# EAGLE design nano24rf (EAGLE 8.0.0)

## Sheet 1 of 2
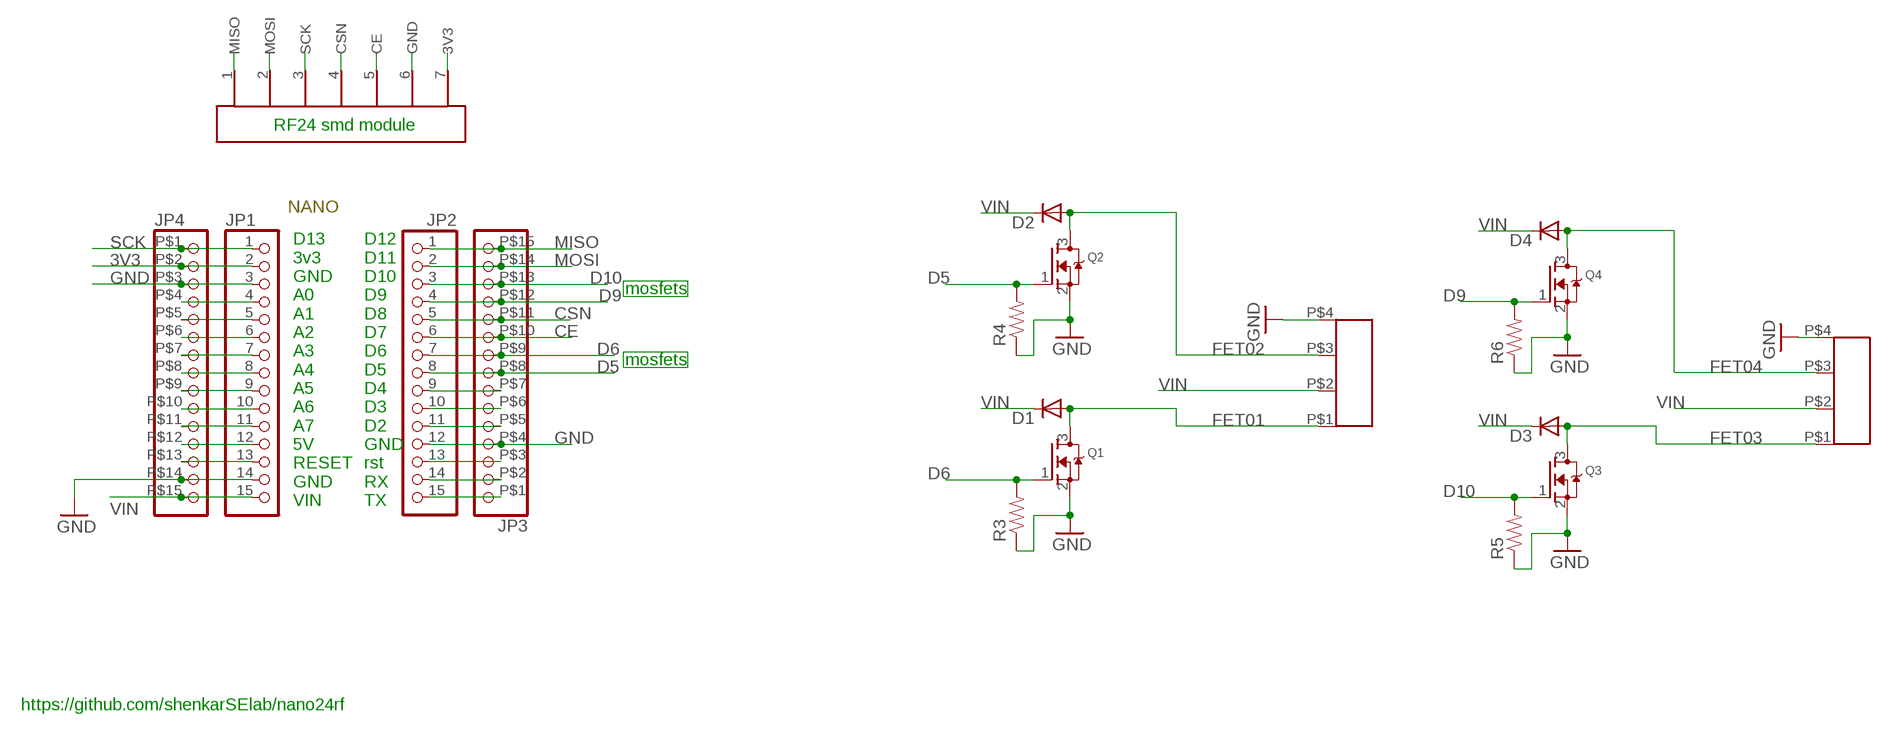
[diagram p0: schematic, sheet 1]

### Parts
D1  DIODE-DO-214AC  [DO-214AC]
D2  DIODE-DO-214AC  [DO-214AC]
D3  DIODE-DO-214AC  [DO-214AC]
D4  DIODE-DO-214AC  [DO-214AC]
JP1  HEADER-1X15RND  [1X15_ROUND_70]
JP2  HEADER-1X15RND  [1X15_ROUND_70]
JP3  HEADER-1X15LONG  [1X15_LONG]
JP4  HEADER-1X15LONG  [1X15_LONG]
MOSFET-12  FATPAD4LONG  [FATFAD4-LONG]
MOSFET-34  FATPAD4LONG  [FATFAD4-LONG]
Q1  MOSFET-NWAVE  [SOT23-W]
Q2  MOSFET-NWAVE  [SOT23-W]
Q3  MOSFET-NWAVE  [SOT23-W]
Q4  MOSFET-NWAVE  [SOT23-W]
R3  RESISTOR0805-RES  [0805]
R4  RESISTOR0805-RES  [0805]
R5  RESISTOR0805-RES  [0805]
R6  RESISTOR0805-RES  [0805]
RF24  1X7-SMDPADS  [SMD1,27-2,54]

### Nets
3V3: JP1.2 JP4.P$2 RF24.7(3V3)
CE: JP2.6 JP3.P$10 RF24.5(CE)
CSN: JP2.5 JP3.P$11 RF24.4(CSN)
D5: JP2.8 JP3.P$8 Q2.1(G) R4.2
D6: JP2.7 JP3.P$9 Q1.1(G) R3.2
D9: JP2.4 JP3.P$12 Q4.1(G) R6.2
D10: JP2.3 JP3.P$13 Q3.1(G) R5.2
FET01: D1.2(A) MOSFET-12.P$1 Q1.3(D)
FET02: D2.2(A) MOSFET-12.P$3 Q2.3(D)
FET03: D3.2(A) MOSFET-34.P$1 Q3.3(D)
FET04: D4.2(A) MOSFET-34.P$3 Q4.3(D)
GND: JP1.3 JP1.14 JP2.12 JP3.P$4 JP4.P$3 JP4.P$14 MOSFET-12.P$4 MOSFET-34.P$4 Q1.2(S) Q2.2(S) Q3.2(S) Q4.2(S) R3.1 R4.1 R5.1 R6.1 RF24.6(GND)
MISO: JP2.1 JP3.P$15 RF24.1(MISO)
MOSI: JP2.2 JP3.P$14 RF24.2(MOSI)
N$1: JP1.4 JP4.P$4
N$2: JP1.5 JP4.P$5
N$3: JP1.6 JP4.P$6
N$4: JP1.7 JP4.P$7
N$5: JP1.8 JP4.P$8
N$6: JP1.9 JP4.P$9
N$7: JP1.10 JP4.P$10
N$8: JP1.11 JP4.P$11
N$9: JP1.12 JP4.P$12
N$10: JP1.13 JP4.P$13
N$11: JP2.15 JP3.P$1
N$12: JP2.14 JP3.P$2
N$13: JP2.13 JP3.P$3
N$14: JP2.11 JP3.P$5
N$15: JP2.10 JP3.P$6
N$16: JP2.9 JP3.P$7
SCK: JP1.1 JP4.P$1 RF24.3(SCK)
VIN: D1.1(C) D2.1(C) D3.1(C) D4.1(C) JP1.15 JP4.P$15 MOSFET-12.P$2 MOSFET-34.P$2

### Notes on the sheet
- RF24 smd module
- NANO
- mosfets
- mosfets
- D13
  3v3
  GND
  A0
  A1
  A2
  A3
  A4
  A5
  A6
  A7
  5V
  RESET
  GND
  VIN
- D12
  D11
  D10
  D9
  D8
  D7
  D6
  D5
  D4
  D3
  D2
  GND
  rst
  RX
  TX
- https://github.com/shenkarSElab/nano24rf

## Sheet 2 of 2

## Library data of the parts
D1-D4 = dp_devices:DIODE: Various Diode Packages
JP1-JP4 = nano24rf:HEADER-1X15: 1x15 Header
MOSFET-12 MOSFET-34 = nano24rf:FATPAD4
Q1-Q4 = adafruit:MOSFET-N: N-Channel Mosfet 2N7002E - 60V 260mA SOT23 [Digikey: 2N7002ET1GOSTR-ND] - REEL BSH103 - 30V 850mA SOT23 [Digikey: 568-5013-1-ND]
R3-R6 = ATTAMI-V0.00:RESISTOR: Resistor Basic schematic elements and footprints for 0603, 1206, and PTH resistors.
RF24 = nano24rf:1X7-SMDPADS

## Board
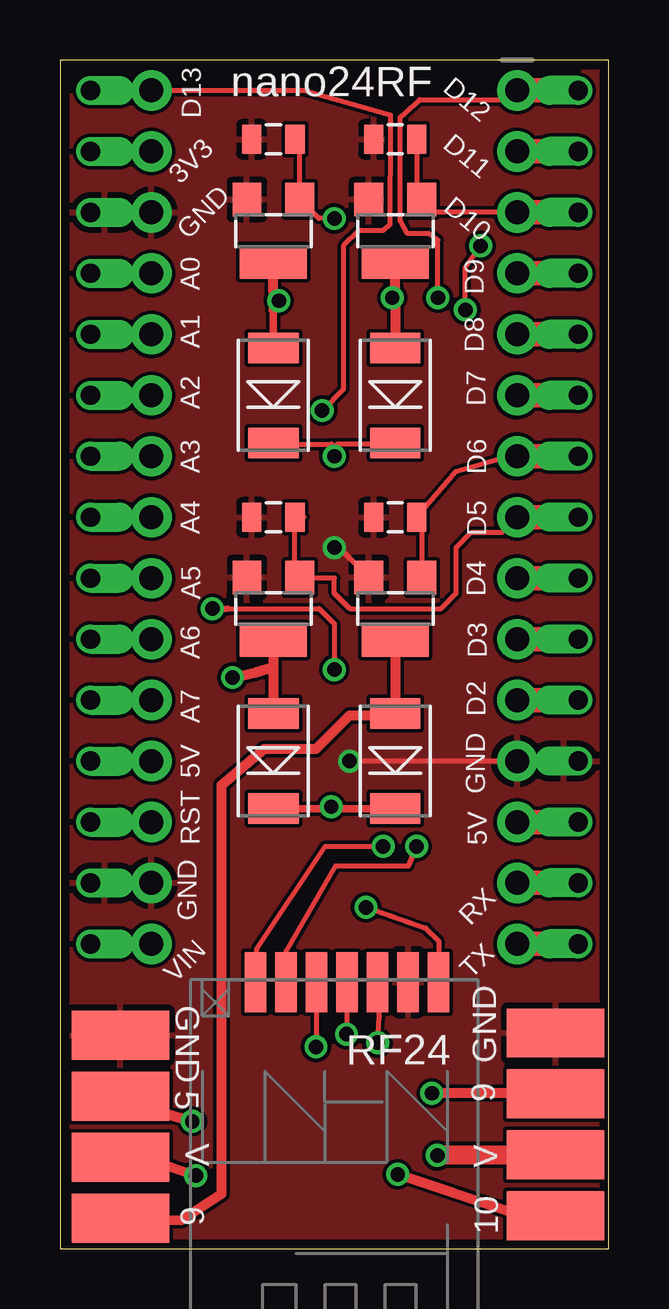
[diagram p1: board, top side]
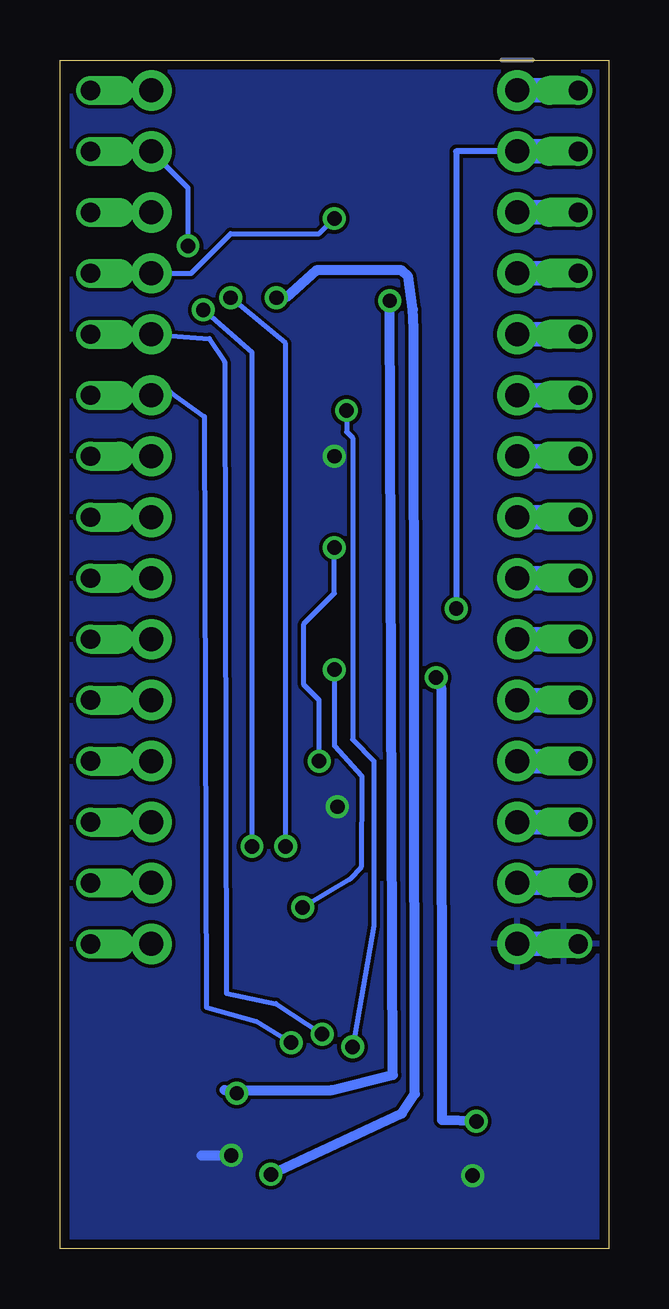
[diagram p2: board, bottom side, seen from below]

Size 22.86 x 49.53 mm. Coordinates in mm from the lower left corner, seen from the top.
Outline: 0,0 22.86,0 22.86,49.53 0,49.53 0,0
Copper layers (1*16): Top 0.0356mm / dielectric 1.5011mm / Bottom 0.0356mm
Design rules "oshpark-2layer": minimum track width 6mil, minimum drill 13mil, track to track 6mil, track to pad 6mil, pad to pad 6mil, via to via 6mil, smd to smd 6mil, copper to edge 15mil, drill to drill 6mil, minimum pad ring 7mil, minimum via ring 7mil, stop-mask expansion 2.5mil, vias tented up to drill 0mil, thermal gap 10mil

### Footprints (pad centres in the part's own frame; a part is rotated, then mirrored left to right if it is on the bottom)
DO-214AC = smd 1.27 x 2.1: 1 -1.98,0; 2 1.98,0
1X15_ROUND_70 = drill 1 pad 1.676: 1 -17.78,0; 2 -15.24,0; 3 -12.7,0; 4 -10.16,0; 5 -7.62,0; 6 -5.08,0; 7 -2.54,0; 8 0,0; 9 2.54,0; 10 5.08,0; 11 7.62,0; 12 10.16,0; 13 12.7,0; 14 15.24,0; 15 17.78,0
1X15_LONG = drill 0.8 offset: P$1 -17.78,0; P$2 -15.24,0; P$3 -12.7,0; P$4 -10.16,0; P$5 -7.62,0; P$6 -5.08,0; P$7 -2.54,0; P$8 0,0; P$9 2.54,0; P$10 5.08,0; P$11 7.62,0; P$12 10.16,0; P$13 12.7,0; P$14 15.24,0; P$15 17.78,0
FATFAD4-LONG = smd 2.032 x 4.064: P$1 -3.81,0; P$2 -1.27,0; P$3 1.27,0; P$4 3.81,0
SOT23-W = smd 1.2 x 1.4: 1 -1.1,-1.3; 2 1.1,-1.3 | smd 2.8 x 1.4: 3 0,1.3
0805 = smd 0.8 x 1.2: 1 -0.9,0; 2 0.9,0
SMD1,27-2,54 = smd 0.9 x 2.5: 1 2.82,-0.19; 2 4.09,-0.19; 3 5.36,-0.19; 4 6.63,-0.19; 5 7.9,-0.19; 6 9.17,-0.19; 7 10.44,-0.19

### Placement (x,y rotation side)
D1  13.97,20.32 90 top
D2  8.89,20.32 90 top
D3  13.97,35.56 90 top
D4  8.89,35.56 90 top
JP1  3.81,30.48 270 bottom
JP2  19.05,30.48 270 top
JP3  21.59,30.48 90 bottom
JP4  1.27,30.48 270 bottom
MOSFET-12  2.51,5.08 90 top
MOSFET-34  20.65,5.18 90 top
Q1  13.97,26.67 180 top
Q2  8.89,26.67 180 top
Q3  13.97,42.42 180 top
Q4  8.89,42.42 180 top
R3  13.97,30.48 0 top
R4  8.89,30.48 0 top
R5  13.97,46.23 0 top
R6  8.89,46.23 0 top
RF24  5.33,11.3 0 top

### Tracks (layer width: path | path; a pad name or v marks a point on that pad's centre or on a via)
3V3  (via drill 0.6)
  Top 0.203: 6.99,26.67 10.8,26.67 11.43,26.04 v11.43,24.13 | v12.75,14.22 15.25,13.36 15.77,12.83 RF24.7
  Top 0.254: v6.35,26.67 6.99,26.67
  Bottom 0.203: v11.43,24.13 11.43,20.95 10.29,19.68 10.31,15.9 10.8,15.39 v12.75,14.22
  Bottom 0.254: JP1.2 6.35,45.72 v6.35,26.67
  Bottom 1.016: JP4.P$2 JP1.2
CE  (via drill 0.6)
  Top 0.203: v13.23,8.59 13.31,9.69 RF24.5
  Top 1.016: JP3.P$10 JP2.6
  Bottom 0.203: JP2.6 18.26,35.69 16.84,34.67 16.76,10.06 14.68,9.47 v13.23,8.59
CSN  (via drill 0.6)
  Top 0.203: v11.94,8.94 11.96,9.46 RF24.4
  Top 1.016: JP3.P$11 JP2.5
  Bottom 0.203: JP2.5 16.64,37.92 16,36.96 15.93,10.64 13.87,10.21 v11.94,8.94
D5
  Top 0.203: 10.16,30.48 R4.2 9.79,28.17 Q2.1 10.02,27.94 11.43,27.94 11.43,27.3 12.07,26.67 15.88,26.67 16.51,27.3 16.51,29.21 17.14,29.84 18.41,29.84 JP2.8
  Top 1.016: JP3.P$8 JP2.8
D6
  Top 0.203: JP2.7 18.68,33.02 16.51,32.38 R3.2 15.07,30.28 Q1.1
  Top 1.016: JP3.P$9 JP2.7
D9  (via drill 0.6)
  Top 0.203: R6.2 arc-90 9.99,46.03 Q4.1 10.78,42.93 v11.43,42.93
  Top 1.016: JP2.4 JP3.P$12
  Bottom 0.203: JP2.4 17.4,40.64 15.75,42.29 12.07,42.29 v11.43,42.93
D10
  Top 0.203: R5.2 14.87,43.92 arc90 Q3.1 15.61,43.18 JP2.3
  Top 1.016: JP2.3 JP3.P$13
FET01
  Top 0.305: 13.89,22.23 D1.2
  Top 0.406: MOSFET-12.P$1 5.05,1.19 6.73,2.29 6.73,19.33 8.51,20.83 10.67,20.83 12.07,22.23 13.89,22.23 | Q1.3 D1.2
FET02  (via drill 0.6)
  Top 0.305: MOSFET-12.P$3 1.98,6.33
  Top 0.406: Q2.3 8.89,24.26 | 8.89,24.26 D2.2 | 1.98,6.33 v5.51,5.31 | v7.19,23.8 8.18,24.03 8.89,24.26
  Bottom 0.406: v5.51,5.31 6.93,5.36 6.96,23.29 7.06,23.75 v7.19,23.8
FET03  (via drill 0.6)
  Top 0.203: MOSFET-34.P$1 18.8,1.52
  Top 0.305: v13.84,39.62 13.97,39.75
  Top 0.406: 18.8,1.52 v14.07,3.1 | 13.97,39.75 Q3.3 | v13.84,39.62 13.97,39.5 D3.2
  Bottom 0.406: v14.07,3.1 8.61,5.64 8.08,6.45 8.13,38.33 8.15,39.14 8.36,40.51 8.61,40.77 12.19,40.77 13.46,39.62 v13.84,39.62
FET04  (via drill 0.6)
  Top 0.203: MOSFET-34.P$3 18.92,6.48
  Top 0.305: 8.89,39.12 D4.2
  Top 0.406: 18.92,6.48 v15.49,6.48 | Q4.3 8.89,39.88 v9.12,39.5 8.89,39.12
  Bottom 0.406: v15.49,6.48 16,6.6 11.56,6.6 8.99,7.24 v9.12,39.5
GND  (via drill 0.6)
  Top 0.203: JP2.12 v12.07,20.32 | v11.43,29.21 11.63,29.21 Q1.2
  Bottom 0.203: v12.07,20.32 12.07,22.86 12.7,23.5 12.7,26.04 11.43,27.3 v11.43,29.21
  Bottom 1.016: JP4.P$3 JP1.3 | JP4.P$14 JP1.14
  pour Top: 0,50.04 0,0 22.99,0 22.96,50.01
MISO  (via drill 0.6)
  Top 0.203: RF24.1 8.21,12.5 11.05,16.76 v13.46,16.76 | JP2.1 18.67,47.88 14.99,47.88 14.17,47.14 14.17,42.82 14.48,42.29 15.37,42.29 15.75,42.04 v15.75,39.62
  Top 1.016: JP3.P$15 JP2.1
  Bottom 0.203: v13.46,16.76 13.46,37.72 v15.75,39.62
MOSI  (via drill 0.6)
  Top 0.203: RF24.2 9.42,12.4 11.48,15.95 14.53,15.95 v14.86,16.76 | v16.89,39.12 16.89,40.89 v17.53,41.78
  Top 1.016: JP3.P$14 JP2.2
  Bottom 0.203: v14.86,16.76 14.86,37.34 v16.89,39.12 | v17.53,41.78 17.53,44.2 JP2.2
N$1
  Bottom 1.016: JP1.4 JP4.P$4
N$2
  Bottom 1.016: JP4.P$5 JP1.5
N$3
  Bottom 1.016: JP1.6 JP4.P$6
N$4
  Bottom 1.016: JP4.P$7 JP1.7
N$5
  Bottom 1.016: JP1.8 JP4.P$8
N$6
  Bottom 1.016: JP4.P$9 JP1.9
N$7
  Bottom 1.016: JP1.10 JP4.P$10
N$8
  Bottom 1.016: JP4.P$11 JP1.11
N$9
  Bottom 1.016: JP4.P$12 JP1.12
N$10
  Bottom 1.016: JP1.13 JP4.P$13
N$11
  Top 1.016: JP2.15 JP3.P$1
N$12
  Top 1.016: JP3.P$2 JP2.14
N$13
  Top 1.016: JP2.13 JP3.P$3
N$14
  Top 1.016: JP2.11 JP3.P$5
N$15
  Top 1.016: JP3.P$6 JP2.10
N$16
  Top 1.016: JP2.9 JP3.P$7
SCK  (via drill 0.6)
  Top 0.203: JP1.1 10.16,48.26 13.77,47.24 13.77,44.83 13.74,44.58 13.74,42.67 13.46,42.42 12.45,42.42 11.81,41.78 11.81,35.81 v10.92,34.92 | v10.67,8.41 10.69,8.83 RF24.3
  Bottom 0.203: v10.92,34.92 10.92,34.04 10.67,33.78 10.67,21.21 9.78,20.32 9.78,13.46 v10.67,8.41
  Bottom 1.016: JP4.P$1 JP1.1
VIN  (via drill 0.6)
  Top 0.203: D4.1 8.94,33.53 11.3,33.53 11.43,33.4 11.56,33.53 13.92,33.53 D3.1
  Top 0.305: 11.43,33.4 v11.43,33.02 | D1.1 D2.1 11.23,18.34 v11.3,18.41
  Top 0.406: MOSFET-12.P$2 3.5,3.81 v5.66,3.05
  Top 0.813: MOSFET-34.P$2 v15.72,3.89
  Bottom 0.305: v11.3,18.41 11.3,18.54
  Bottom 0.406: 16.97,3.89 v15.72,3.89
  Bottom 1.016: JP4.P$15 JP1.15
  pour Bottom: 0,50.29 0,0 22.99,0 23.04,50.37

### Text on the board
tPlace: nano24RF | D12 | D13 | D11 | 3V3 | D10 | GND | A0 | D9 | A1 | D8 | A2 | D7 | A3 | D6 | A4 | D5 | A5 | D4 | A6 | D3 | A7 | D2 | 5V | GND | RST | 5V | GND | RX | VIN | TX | GND | GND | 5 | 9 | V | V | 6 | 10
tValues: nano24RF